# Altium project LMP9100.PrjPcb
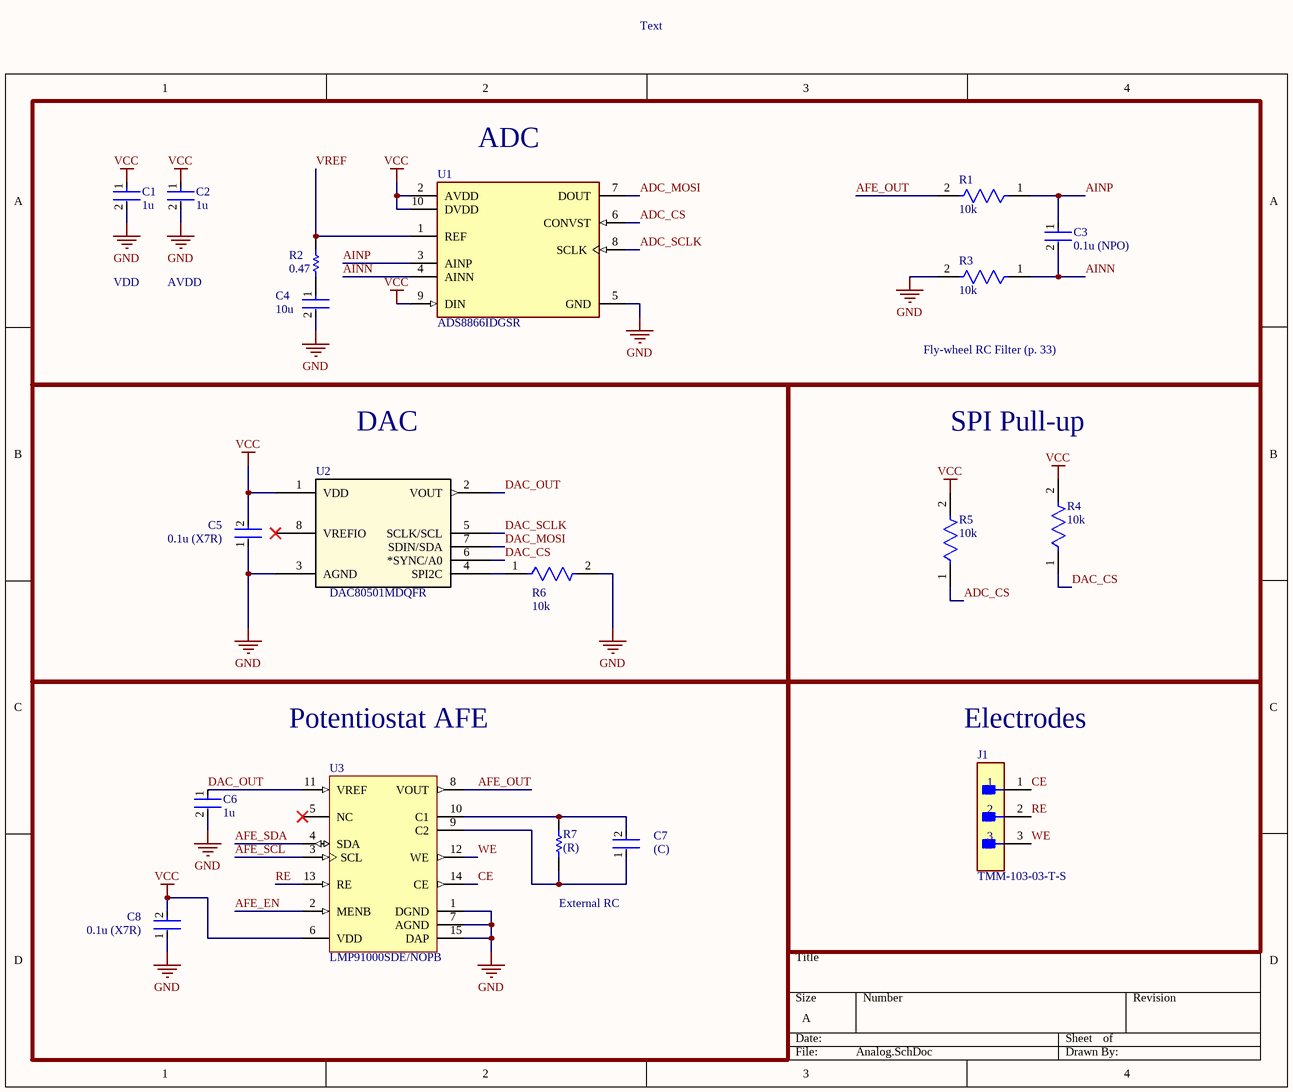
[diagram p0: Analog.SchDoc]
3 sheets, 36 parts. Net scope: global (net labels, ports and power ports of the same name join across sheets).
Board file: LMP9100.PcbDoc
Sheets:
  Analog.SchDoc
  MCU.SchDoc
  Power.SchDoc

## Sheet Analog.SchDoc
size A; SheetNumber: 1; SheetTotal: 3

### Parts
C1  1u  [FP-GCM188-0_1-IPC_B]
C2  1u  [FP-GCM188-0_1-IPC_B]
C3  0.1u (NPO)  [FP-GRM319-0_15-MFG]
C4  10u  [FP-GRM21B-0_15-MFG]
C5  0.1u (X7R)  [FP-GCJ188-0_2-IPC_C]
C6  1u  [FP-GCM188-0_1-IPC_B]
C7  (C)  [FP-GCJ188-0_2-IPC_C]
C8  0.1u (X7R)  [FP-GCJ188-0_2-IPC_C]
J1  TMM-103-03-T-S  [FP-TMM-103-03-T-S-MFG]
R1  10k  [FP-CPF0603-MFG]
R2  0.47  [RESC1608X55X30ML15T15]
R3  10k  [FP-CPF0603-MFG]
R4  10k  [FP-CPF0603-MFG]
R5  10k  [FP-CPF0603-MFG]
R6  10k  [FP-CPF0603-MFG]
R7  (R)  [RESC1005X40X25NL05T10]
U1  ADS8866IDGSR  [FP-DGS0010A-IPC_A]
U2  DAC80501MDQFR  [WSON8_2P1X2P1_TEX]
U3  LMP91000SDE/NOPB  [NHL0014B_V]

### Blocks framed on the sheet
ADC: C1-C4 R1-R3 U1
DAC: C5 R6 U2
SPI Pull-up: R4 R5
Potentiostat AFE: C6-C8 R7 U3
Electrodes: J1

### Nets
GND: C1.2 C2.2 C4.2 C5.1 C6.2 C8.1 R3.2 R6.2 U1.5(GND) U2.3(AGND) U3.1(DGND) U3.7(AGND) U3.15(DAP)
VCC: C1.1 C2.1 C5.2 C8.2 R4.2 R5.2 U1.2(AVDD) U1.9(DIN) U1.10(DVDD) U2.1(VDD) U3.6(VDD)
ADC_CS: R5.1 U1.6(CONVST)
ADC_MOSI: U1.7(DOUT)
ADC_SCLK: U1.8(SCLK)
AFE_EN: U3.2(MENB)
AFE_OUT: R1.2 U3.8(VOUT)
AFE_SCL: U3.3(SCL)
AFE_SDA: U3.4(SDA)
AINN: C3.2 R3.1 U1.4(AINN)
AINP: C3.1 R1.1 U1.3(AINP)
CE: J1.1 U3.14(CE)
DAC_CS: R4.1 U2.6(*SYNC/A0)
DAC_MOSI: U2.7(SDIN/SDA)
DAC_OUT: C6.1 U2.2(VOUT) U3.11(VREF)
DAC_SCLK: U2.5(SCLK/SCL)
RE: J1.2 U3.13(RE)
VREF: R2.2 U1.1(REF)
WE: J1.3 U3.12(WE)
NetC4_1: C4.1 R2.1
NetC7_1: C7.1 R7.1 U3.9(C2)
NetC7_2: C7.2 R7.2 U3.10(C1)
NetR6_1: R6.1 U2.4(SPI2C)

Not connected (* = marked no-connect by the designer): U2 8(VREFIO)*; U3 5(NC)*

### Notes on the sheet
- Text
- VDD
- AVDD
- Fly-wheel RC Filter (p. 33)
- External RC

### Library data of the parts
C1 C2 C6 = CMP-2006-02357-2: Ceramic Capacitor for Automotive 1uF  ±10% 16VDC X7R 0603 Paper T/R; Voltage: 16V; Thickness: 0.035inch; Width: 0.031inch; Radiation Hardening: No; Depth: 0.8mm; Max Operating Temperature: 125°C; Package Quantity: 1; Ratings: AEC-Q200; Min Operating Temperature: -55°C; Packaging: Tape and Reel; Case Code (Metric): 1608; REACH SVHC: No SVHC; Dielectric: X7R; Case Code (Imperial): 0603; Length: 1.6mm; Height: 0.8mm; Voltage Rating: 16V; Termination: SMD/SMT; Case/Package: 0603; Voltage Rating (DC): 16V; Tolerance: 10%; Capacitance: 1uF; Mount: Surface Mount; Lead Free: Lead Free
C3 = CMP-06035-028588-1: Chip Multilayer Ceramic Capacitors for General Purpose, 1206, 0.10uF, C0G, 30ppm/°C, 5%, 50V
C4 = CMP-2000-07555-2: Chip Multilayer Ceramic Capacitors for General Purpose, 0805, 10uF, X7R, 15%, 10%, 10V; Length: 2mm; Case Code (Metric): 2012; Height: 1.25mm; Tolerance: 10%; Width: 1.25mm; Voltage Rating: 10V; Voltage Rating (DC): 10V; Case/Package: 0805; Package Quantity: 3000; Capacitance: 10uF; REACH SVHC: No SVHC; Case Code (Imperial): 0805; Min Operating Temperature: -55°C; Termination: SMD/SMT; Depth: 1.25mm; Mount: Surface Mount; Thickness: 0.055inch; Max Operating Temperature: 125°C; Weight: 0.000335oz; Dielectric: X7R; Packaging: Tape and Reel
C5 C7 C8 = CMP-2006-02223-2: Cap Ceramic 0.1uF 50V X7R 10% Pad SMD 0603 Soft Termination +125°C Automotive T/R; Capacitance: 100nF; Radiation Hardening: No; Dielectric: X7R; Voltage Rating (DC): 50V; Case Code (Imperial): 0603; Length: 1.6mm; Features: Soft Termination; Case Code (Metric): 1608; Case/Package: 0603; Termination: SMD/SMT; Packaging: Tape and Reel; Height: 0.8mm; Tolerance: 10%; Thickness: 0.035inch; Width: 0.031inch; Voltage Rating: 50V; Min Operating Temperature: -55°C; Ratings: AEC-Q200; Package Quantity: 1; Depth: 0.8mm; Mount: Surface Mount; Lead Free: Lead Free; Max Operating Temperature: 125°C
J1 = CMP-02766-001695-1: CONN HEADER VERT 3POS 2MM; Gender: Male; Number of Positions: 3; Max Current Rating: 3.9A; Max Voltage Rating (AC): 500V; Packaging: Bulk; RoHS Compliant: Yes; Mount: Through Hole; Length: 6mm; Contact Type: Male Pin; Package Quantity: 1; Depth: 1.97mm; Contact Material: Bronze; Insulation Material: Polymer; Series: TMM; Contact Plating: Tin; Fastening Type: Pull; Housing Color: Black; Pitch: 2mm; Termination: Solder; Contact Mating Length: 0.157inch; Min Operating Temperature: -55°C; REACH SVHC: No SVHC; Orientation: Straight; Number of Rows: 1; Color: Black; Insulation Color: Black; Connector Type: Header; Radiation Hardening: No; Number of Contacts: 3; Lead Free: Lead Free; Contact Finish - Mating: TIN; Max Operating Temperature: 105°C; Housing Material: Polymer; Contact Shape: Square
R1 R3-R6 = CMP-03211-008304-1: RES SMD 10KΩ 1% 1/16W 0603; Manufacturer Part Number: CPF0603F10KC1; Manufacturer: TE Connectivity; Voltage Rating: 50V; Temperature Coefficient: 50ppm/°C; Power Rating: 0.063W; Device Class L2: Resistors; Ipc Land Pattern Name: RESC15580X45; Device Class L3: Chip SMD Resistors; Automotive: No; Temperature Range High: +155°C; Temperature: -55°C to +155°C; Lead Free: Yes; Device Class L1: Passive Components; Tolerance: 1%; packaging: 1k Reel; ComponentLink2URL: https://www.te.com/commerce/DocumentDelivery/DDEController?Action=showdoc&DocId=Data+Sheet%7F1773200%7FM%7Fpdf%7FEnglish%7FENG_DS_1773200_M.pdf%7F3-1676481-2; octopart_url: https://octopart.com/cpf0603f10kc1-te+connectivity-42013076; Composition: Thin Film; Height: 0.55mm; RoHS: TRUE; Value: 10KΩ; Resistance: 10KΩ; Series: CPF; ComponentLink2Description: Datasheet; Category: Res; Octopart: https://octopart.com/cpf0603f10kc1-te+connectivity-42013076; Temperature Range Low: -55°C; Package: CPF0603
R2 = CMP-2000-00857-1: Manufacturer: Panasonic; Part Number: ERJ-3RQFR47V
R7 = CMP-2002-07044-1: Manufacturer: Yageo / Phycomp; Part Number: RC0402FR-073M3L
U1 = CMP-04860-000035-1: IC ADC 16BIT SAR 10VSSOP; Max Power Dissipation: 1.2mW; Sampling Rate: 100000S/s; Nominal Supply Current: 230uA; Polarity: Unipolar; Max Supply Voltage: 3.6V; Supply Type: Analog; Number of Analog Inputs: 1; Number of Bits: 16; Power Dissipation: 700uW; Interface: SPI; Signal to Noise Ratio (SNR): 93dB; Resolution: 16b; Integral Nonlinearity (INL): 2LSB; Min Supply Voltage: 2.7V; Lead Free: Lead Free; Min Operating Temperature: -40°C; Case/Package: VSSOP; Max Operating Temperature: 85°C; Packaging: Cut Tape; Package Quantity: 2500; REACH SVHC: No SVHC; Contact Plating: Gold; Mount: Surface Mount; Number of Pins: 10; RoHS Compliant: Yes; Number of A/D Converters: 1; Number of Inputs: 1
U2 = DAC80501MDQFR: True 16-bit, 1-ch, SPI/I2C, voltage-output DAC in WSON package with precision internal reference; Mfr_Name: Texas Instruments; RefDes: RefDes; Type: Type; Supplier 1: Mouser; Supplier Part Number 1: 595-DAC80501MDQFR
U3 = CMP-0064-00201-2: Configurable AFE Potentiostat for Low-Power Chemical Sensing Applications, 14-pin LLP, 250 Reel; Manufacturer: Texas Instruments; PowerWise: N; PackageTopMarking: NS*UZXYTT*L91000; CompType: OtherParts; PackageDescription: LLP, Plastic, Dual, 4 x 4 x 0.8mm Body, 14 Lead, 0.5mm Pitch, No Pullback; ComponentLink1URL: http://www.ti.com/general/docs/lit/getliterature.tsp?genericPartNumber=LMP91000&fileType=pdf; ComponentLink1Description: Datasheet URL; PinCount: 14; RoHS: Y; PackageReference: NHL0014B

## Sheet MCU.SchDoc
size A; SheetNumber: 2; SheetTotal: 3
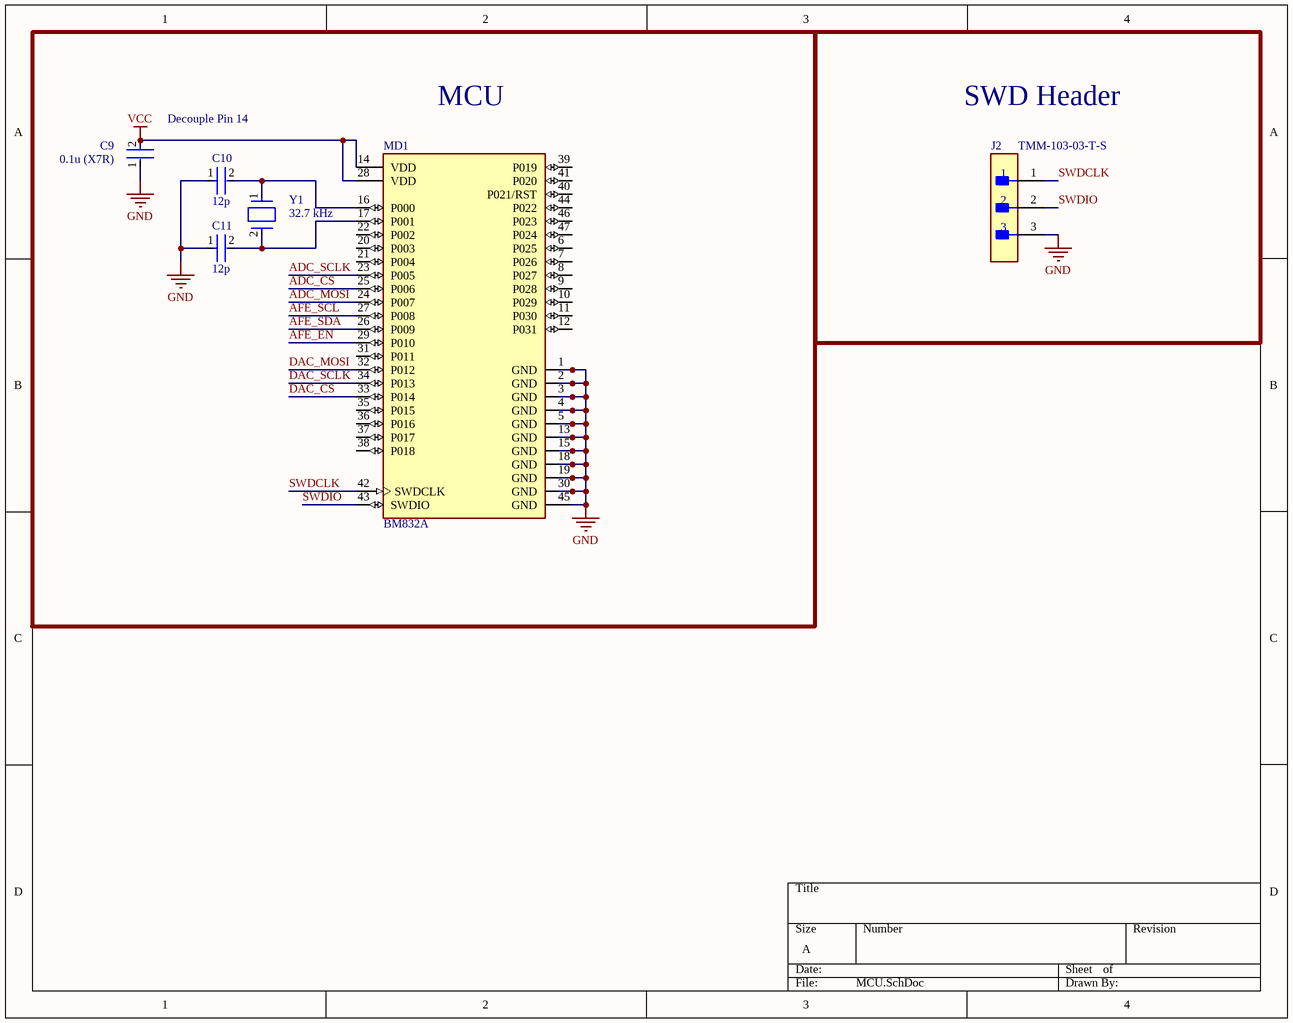
[diagram p1: MCU.SchDoc]

### Parts
C9  0.1u (X7R)  [FP-GCJ188-0_2-IPC_C]
C10  12p  [FP-GCM188-0_1-IPC_B]
C11  12p  [FP-GCM188-0_1-IPC_B]
J2  TMM-103-03-T-S  [FP-TMM-103-03-T-S-MFG]
MD1  BM832A  [FP-BM832A-MFG]
Y1  32.7 kHz  [FP-ECS-CDX-MFG]

### Blocks framed on the sheet
MCU: C9-C11 MD1 Y1
SWD Header: J2

### Nets
GND: C9.1 C10.1 C11.1 J2.3 MD1.1(GND) MD1.2(GND) MD1.3(GND) MD1.4(GND) MD1.5(GND) MD1.13(GND) MD1.15(GND) MD1.18(GND) MD1.19(GND) MD1.30(GND) MD1.45(GND)
VCC: C9.2 MD1.14(VDD) MD1.28(VDD)
ADC_CS: MD1.25(P006)
ADC_MOSI: MD1.24(P007)
ADC_SCLK: MD1.23(P005)
AFE_EN: MD1.29(P010)
AFE_SCL: MD1.27(P008)
AFE_SDA: MD1.26(P009)
DAC_CS: MD1.33(P014)
DAC_MOSI: MD1.32(P012)
DAC_SCLK: MD1.34(P013)
SWDCLK: J2.1 MD1.42(SWDCLK)
SWDIO: J2.2 MD1.43(SWDIO)
NetC10_2: C10.2 MD1.16(P000) Y1.1(In/Out)
NetC11_2: C11.2 MD1.17(P001) Y1.2(Out/In)

Not connected (* = marked no-connect by the designer): MD1 6(P025) 7(P026) 8(P027) 9(P028) 10(P029) 11(P030) 12(P031) 20(P003) 21(P004) 22(P002) 31(P011) 35(P015) 36(P016) 37(P017) 38(P018) 39(P019) 40(P021/RST) 41(P020) 44(P022) 46(P023) 47(P024)

### Notes on the sheet
- Decouple Pin 14

### Library data of the parts
C9 = CMP-2006-02223-2: as C5 on sheet Analog; Radiation Hardening: No; Dielectric: X7R; Voltage Rating (DC): 50V; Case Code (Imperial): 0603; Length: 1.6mm; Features: Soft Termination; Case Code (Metric): 1608; Case/Package: 0603; Termination: SMD/SMT; Packaging: Tape and Reel; Height: 0.8mm; Tolerance: 10%; Thickness: 0.035inch; Width: 0.031inch; Voltage Rating: 50V; Min Operating Temperature: -55°C; Ratings: AEC-Q200; Package Quantity: 1; Depth: 0.8mm; Mount: Surface Mount; Lead Free: Lead Free; Max Operating Temperature: 125°C
C10 C11 = CMP-06035-018127-1: Ceramic Capacitor for Automotive 12pF  ±1% 100VDC C0G 0603 Paper T/R
J2 = CMP-02766-001695-1: as J1 on sheet Analog; Packaging: Bulk; RoHS Compliant: Yes; Mount: Through Hole; Length: 6mm; Contact Type: Male Pin; Package Quantity: 1; Depth: 1.97mm; Contact Material: Bronze; Insulation Material: Polymer; Series: TMM; Contact Plating: Tin; Fastening Type: Pull; Housing Color: Black; Pitch: 2mm; Termination: Solder; Contact Mating Length: 0.157inch; Min Operating Temperature: -55°C; REACH SVHC: No SVHC; Orientation: Straight; Number of Rows: 1; Color: Black; Insulation Color: Black; Connector Type: Header; Radiation Hardening: No; Number of Contacts: 3; Lead Free: Lead Free; Contact Finish - Mating: TIN; Max Operating Temperature: 105°C; Housing Material: Polymer; Contact Shape: Square
MD1 = CMP-216577-000005-1: RX TXRX MODULE BT PCB TRC SMD; Sensitivity: -96dBm; Interface: I2C; Frequency: 2.4GHz; Data Rate: 1Mbps; Memory Size: 24KB; Series: -; Case/Package: SMD/SMT; Mount: Surface Mount; Min Operating Temperature: -40°C; Max Operating Temperature: 85°C
Y1 = CMP-40224-000016-1: CRYSTAL 32.7680KHZ 12.5PF SMD; ESR (Equivalent Series Resistance): 70kR; Frequency: 32.768kHz; Frequency Tolerance: 5ppm; Load Capacitance: 12.5pF; Packaging: Tape and Reel; Case/Package: SMD/SMT; Min Operating Temperature: -40°C; Max Operating Temperature: 85°C; Mount: Surface Mount

## Sheet Power.SchDoc
size A; SheetNumber: 3; SheetTotal: 3
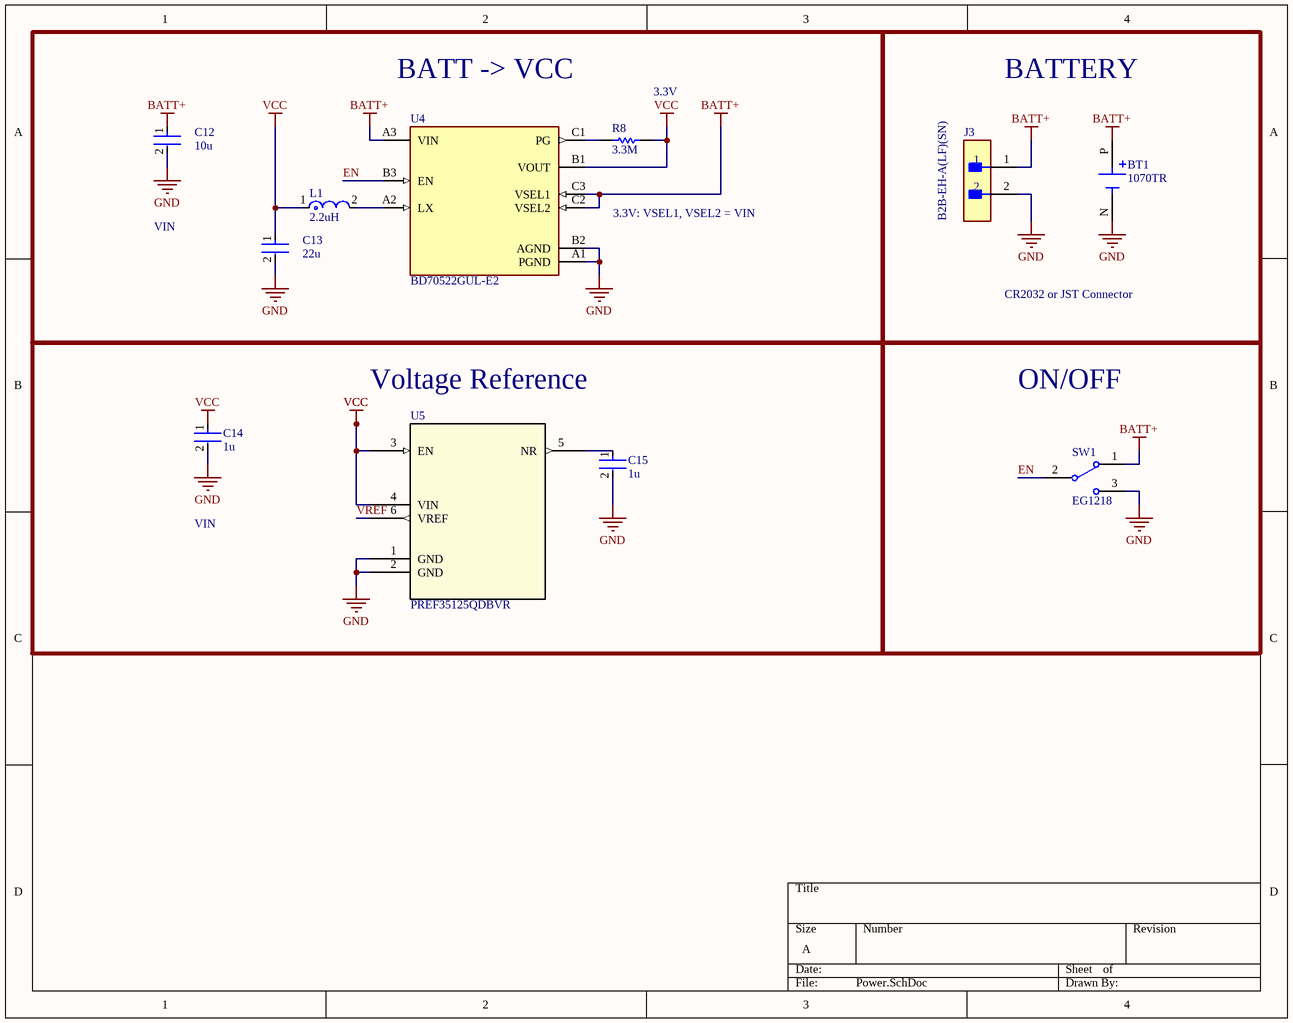
[diagram p2: Power.SchDoc]

### Parts
BT1  1070TR  [KEYSTONE_1070TR]
C12  10u  [FP-GCM31C-0_2-e0_3_0_8-IPC_A]
C13  22u  [FP-GRM32E-0_3-0_2-IPC_B]
C14  1u  [FP-GCM188-0_1-IPC_B]
C15  1u  [FP-GCM188-0_1-IPC_B]
J3  B2B-EH-A(LF)(SN)  [FP-B2B-EH-A_LF_SN-MFG]
L1  2.2uH  [FP-DG6050C-MFG]
R8  3.3M  [RESC1005X40X25NL05T10]
SW1  EG1218  [ESWI-EG1218_V]
U4  BD70522GUL-E2  [FP-VCSP50L1C-IPC_C]
U5  PREF35125QDBVR  [SOT23_DBV_TEX]

### Blocks framed on the sheet
BATT -> VCC: C12 C13 L1 R8 U4
BATTERY: BT1 J3
Voltage Reference: C14 C15 U5
ON/OFF: SW1

### Nets
BATT+: BT1.P(POS) C12.1 J3.1 SW1.1 U4.A3(VIN) U4.C2(VSEL2) U4.C3(VSEL1)
GND: BT1.N(NEG) C12.2 C13.2 C14.2 C15.2 J3.2 SW1.3 U4.A1(PGND) U4.B2(AGND) U5.1(GND) U5.2(GND)
VCC: C13.1 C14.1 L1.1 R8.2 U4.B1(VOUT) U5.3(EN) U5.4(VIN)
EN: SW1.2(COM) U4.B3(EN)
VREF: U5.6(VREF)
NetC15_1: C15.1 U5.5(NR)
NetL1_2: L1.2 U4.A2(LX)
NetR8_1: R8.1 U4.C1(PG)

### Notes on the sheet
- (near R8) 3.3V
- VIN
- 3.3V: VSEL1, VSEL2 = VIN
- CR2032 or JST Connector

### Library data of the parts
C12 = CMP-06035-027091-1: Ceramic Capacitor for Automotive 10uF ±10% 16VDC X7R 1206 Embossed T/R; Voltage Rating: 16V; Package Quantity: 6000; Mount: Surface Mount; Case Code (Metric): 3216; Width: 1.6mm; Capacitance: 10uF; Max Operating Temperature: 125°C; Length: 3.2mm; Case/Package: 1206; Depth: 1.6mm; Tolerance: 10%; Height: 1.6mm; Radiation Hardening: No; Voltage Rating (DC): 16V; Case Code (Imperial): 1206; Termination: SMD/SMT; Min Operating Temperature: -55°C; Dielectric: X7R; Packaging: Tape and Reel
C13 = CMP-06035-011048-1: Chip Multilayer Ceramic Capacitors for General Purpose, 1210, 22uF, X7R, 15%, 10%, 16V; Case Code (Metric): 3225; Case Code (Imperial): 1210; Capacitance: 22uF; Case/Package: 1210; Min Operating Temperature: -55°C; Tolerance: 10%; Resistor Type: Ceramic; Mount: Surface Mount; REACH SVHC: No SVHC; Dielectric: X7R; Packaging: Tape and Reel; Voltage: 16V; Voltage Rating (DC): 16V; Weight: 0.00388oz; Height: 2.5mm; Material: Ceramic; Voltage Rating: 16V; Width: 2.5mm; Max Operating Temperature: 125°C; Package Quantity: 1; Radiation Hardening: No; Length: 3.2mm; Depth: 1.6mm; Thickness: 0.106inch; Lead Free: Lead Free; Termination: SMD/SMT
C14 C15 = CMP-2006-02357-2: as C1 on sheet Analog; Thickness: 0.035inch; Width: 0.031inch; Radiation Hardening: No; Depth: 0.8mm; Max Operating Temperature: 125°C; Package Quantity: 1; Ratings: AEC-Q200; Min Operating Temperature: -55°C; Packaging: Tape and Reel; Case Code (Metric): 1608; REACH SVHC: No SVHC; Dielectric: X7R; Case Code (Imperial): 0603; Length: 1.6mm; Height: 0.8mm; Voltage Rating: 16V; Termination: SMD/SMT; Case/Package: 0603; Voltage Rating (DC): 16V; Tolerance: 10%; Capacitance: 1uF; Mount: Surface Mount; Lead Free: Lead Free
J3 = CMP-17439-000026-1: CONN HEADER VERT 2POS 2.5MM; Number of Contacts: 2; Current Rating: 3A; Connector Type: Plug; Contact Resistance: 20mR; Gender: Male; Voltage Rating: 250V; Fastening Type: Detent; Depth: 3.8mm; Max Operating Temperature: 85°C; Orientation: Straight; Series: EH; Contact Plating: Tin; Min Operating Temperature: -25°C; Contact Type: Male Pin; Housing Color: White; Termination: Press-Fit; Housing Material: Nylon; Pitch: 2.5mm; Number of Positions: 2; Max Current Rating: 3A; Packaging: Bulk; Lead Free: Lead Free; Number of Rows: 1; Length: 7.5mm; Contact Mating Length: 0.13inch; Color: Natural; Max Voltage Rating (AC): 250V; Contact Material: Copper Alloy; Mount: Through Hole
L1 = CMP-06042-016402-1: FIXED IND 2.2UH 7.8A 19.2 MOHM; Test Frequency: 100kHz; Core Material: Ferrite; DC Resistance (DCR): 19.2mR; Tolerance: 30%; Shielding: Shielded; Max DC Current: 5.3A; Case/Package: Nonstandard; Length: 0.248inch; RoHS Compliant: Yes; Packaging: Tape and Reel; Mount: Surface Mount; Height - Seated (Max): 0.198inch; Inductance: 2.2uH; Resistor Type: Wirewound; Width: 0.248inch; Current Rating: 7.8A
R8 = CMP-2002-07044-1: as R7 on sheet Analog
SW1 = CMP-1696-00002-1: Slide Switch, 500 V, -20 to 70 degC, 3-Pin THD, RoHS; Case\Package: SOT-23-5; Output Current: 150 mA; Nominal Output Voltage: 3.3 V; Max Power Dissipation: 250 mW; Min Input Voltage: 4.3 V; Outputs: 1; Max Input Voltage: 8 V; Dropout Voltage: 300 mV; PackageDescription: 3-Pin Through Hole Device, Body 11.6 x 4 mm, Pitch 2.5 mm; ComponentLink1URL: http://www.e-switch.ch/en/; RoHSCompliant: true; Length: 3 mm; ComponentLink1Description: Manufacturer URL; Power Rating: 250 mW; Mount: Surface Mount; Max Operating Temperature: 85 degC; REACH SVHC: No SVHC; Radiation Hardening: No; Height: 1.3 mm; Pins: 5; Max Ouput Current: 150 mA; Output Voltage: 3.3 V; Width: 1.8 mm; Package Quantity: 3000; ComponentLink2URL: https://www.e-switch.com/system/asset/product_line/data_sheet/119/EG.pdf; Min Operating Temperature: -40 degC; ComponentLink2Description: Datasheet; DatasheetVersion: Oct-15; PackageReference: EG1218; Packaging: Tape and Reel
U4 = CMP-08938-000003-1: IC REG BUCK ADJ 500MA VCSP50L1; Manufacturer: Rohm; Output Type: AdjustableProgrammable; Max Power Dissipation: 0.592W; Number Of Outputs: 1; Output Voltage: 1.2/1.5/1.8/2.0/2.5/2.8/3.0/3.2/3.3V; Max Junction Temp: +150°C; Max Duty Cycle: 100%; Nominal Supply Current: 0.18uA; Max Supply Voltage: 5.5V; Switching Frequency: 1MHz; Standoff Height: 0.05mm; Min Supply Voltage: 2.5V; ComponentLink2Description: Datasheet; Device Class L3: Voltage Regulators - Switching; Switching Topology: Buck; Output Current: 500mA; Temperature Range High: +85°C; Digikey Description: IC REG BUCK ADJ 500MA VCSP50L1; Category: IC; Octopart: https://octopart.com/bd70522gul-e2-rohm-88248999; ComponentLink2URL: https://www.rohm.com/datasheet/BD70522GUL/bd70522gul-e; Device Class L2: Power Management ICs; Temperature Range Low: -40°C; RoHS: TRUE; Package: VCSP50L1C; Ipc Land Pattern Name: BGA9N50P3X3_156X176X56; Lead Free: Yes; Temperature: -40°C to +85°C; Device Class L1: Integrated Circuits (ICs); Height: 0.57mm; Automotive: No; Mouser Description: Ultra Low Iq Buck Converter 1MHz 500mA 1.2V to 3.3V Adjustable 50-Pin VCSP Emboss T/R; Manufacturer Part Number: BD70522GUL-E2
U5 = PREF35125QDBVR: 650-nA quiescent current, 12-ppm/°C drift, ultra-low-power precision voltage reference; Mfr_Name: Texas Instruments; RefDes: RefDes; Type: Type; Supplier 1: Digikey; Supplier Part Number 1: 296-REF35300QDBVRCT-ND
BT1 = 1070TR: Package: None; Availability: Unavailable; Value: *; MP: 1070TR; Price: None; Supplier 1: Digikey; Supplier Part Number 1: 36-1070CT-ND

## Nets that join several sheets
GND: Analog (13 pins), MCU (15 pins), Power (11 pins)
VCC: Analog (11 pins), MCU (C9.2 MD1.14 MD1.28), Power (7 pins)
ADC_CS: Analog (R5.1 U1.6), MCU (MD1.25)
ADC_MOSI: Analog (U1.7), MCU (MD1.24)
ADC_SCLK: Analog (U1.8), MCU (MD1.23)
AFE_EN: Analog (U3.2), MCU (MD1.29)
AFE_SCL: Analog (U3.3), MCU (MD1.27)
AFE_SDA: Analog (U3.4), MCU (MD1.26)
DAC_CS: Analog (R4.1 U2.6), MCU (MD1.33)
DAC_MOSI: Analog (U2.7), MCU (MD1.32)
DAC_SCLK: Analog (U2.5), MCU (MD1.34)
VREF: Analog (R2.2 U1.1), Power (U5.6)